# EAGLE design GS_maha (EAGLE 9.6.1)

## Sheet 1 of 2
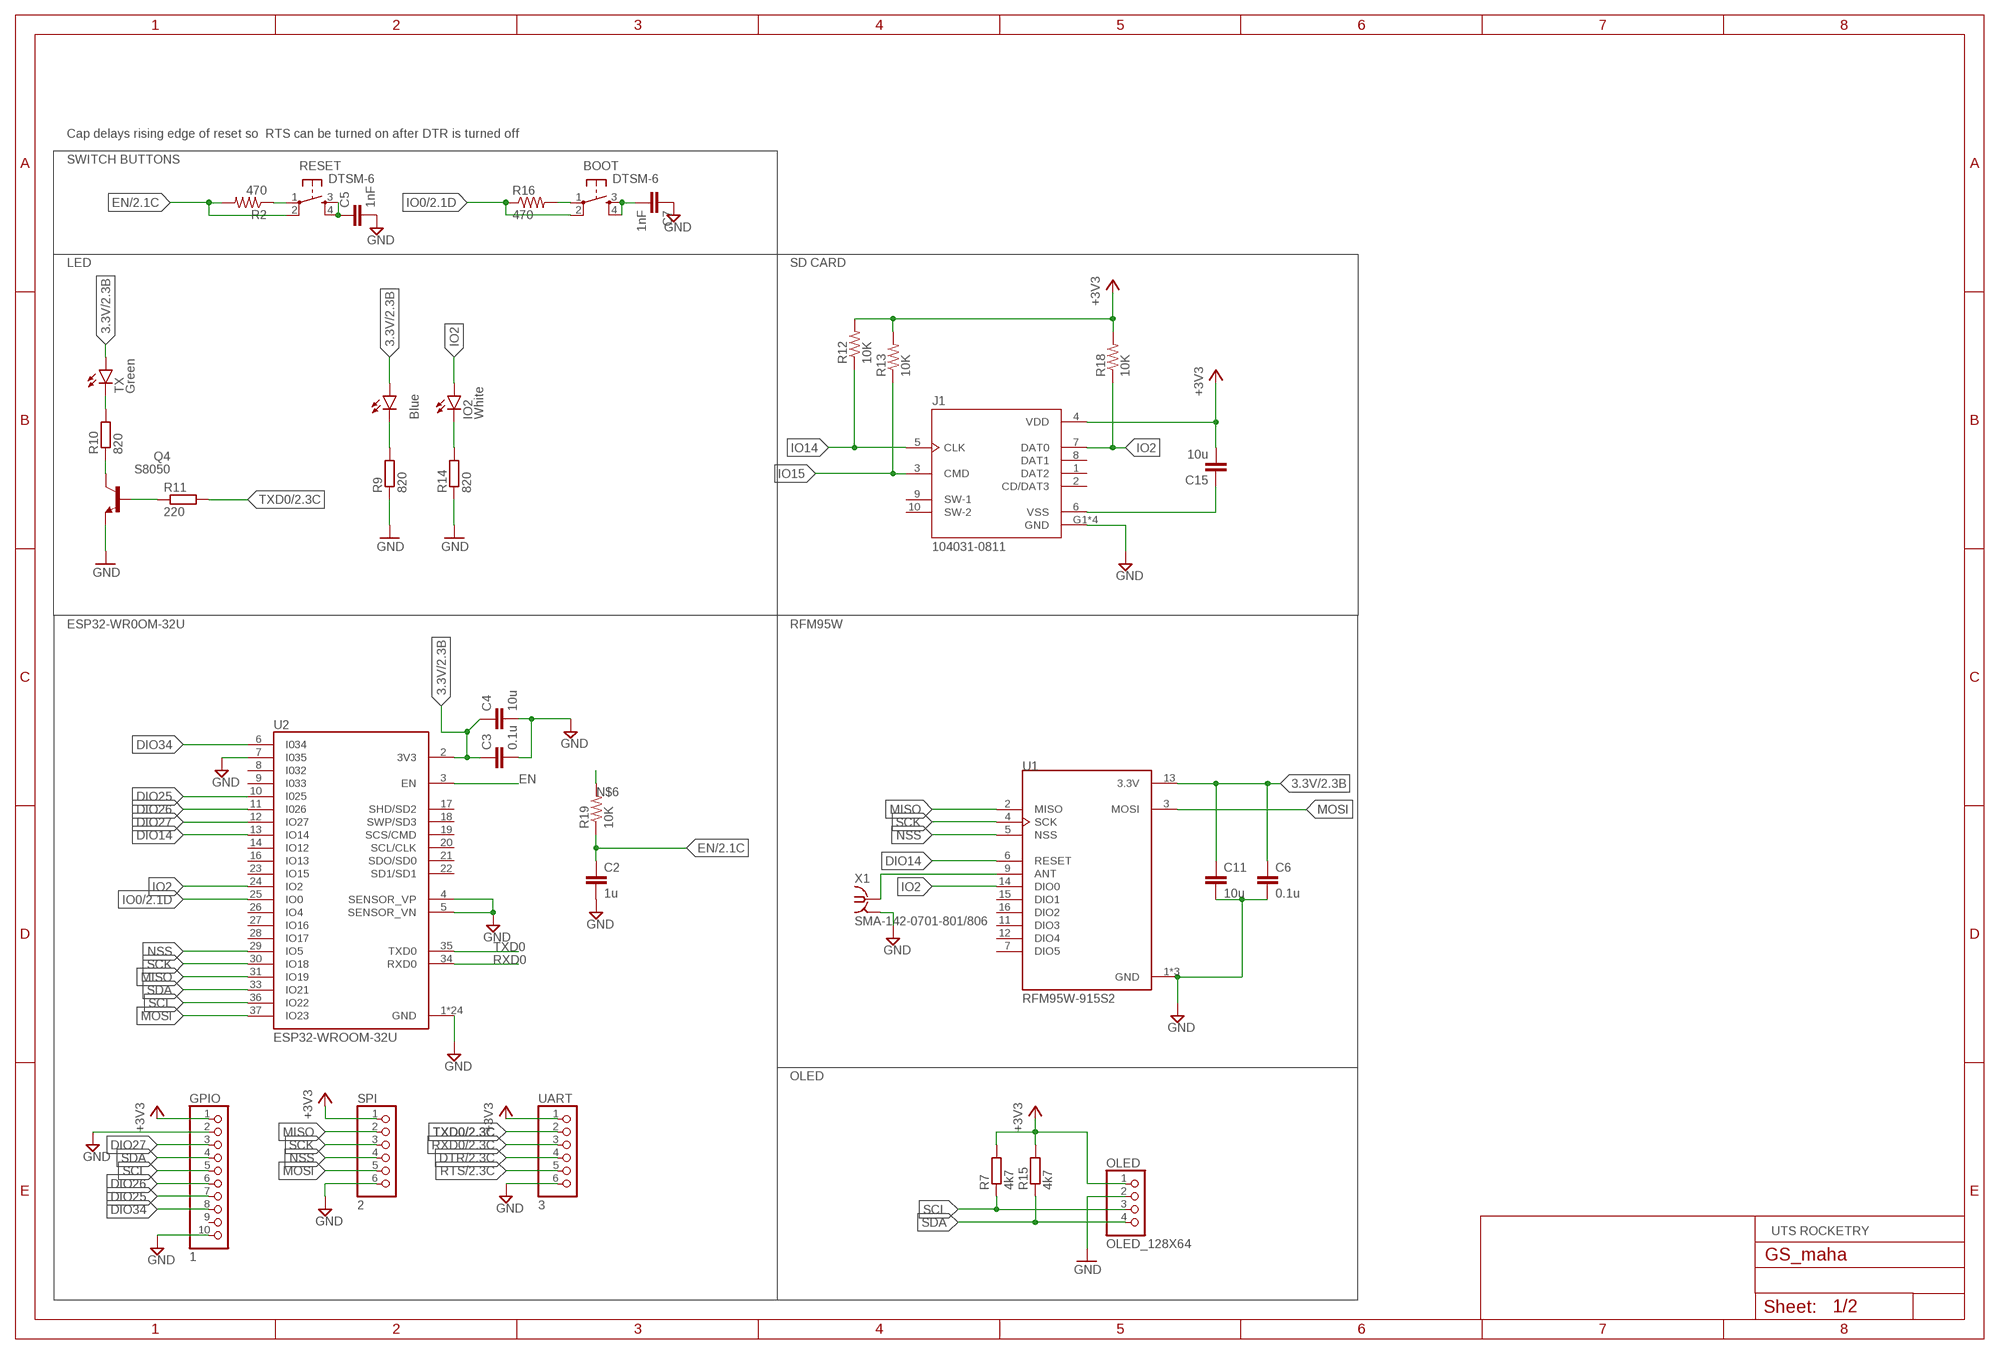
[diagram p0: schematic, sheet 1]

### Parts
BOOT  DTSM-6  [DTSM-6]
C2  1u  C-EUC0805  [C0805]
C3  0.1u  C-EUC0805  [C0805]
C4  10u  C-EUC0805  [C0805]
C5  1nF  C-EUC0805  [C0805]
C6  0.1u  C-EUC0805  [C0805]
C7  1nF  C-EUC0805  [C0805]
C11  10u  C-EUC0805  [C0805]
C15  10u  C-EUC0805  [C0805]
GPIO  1  PINHD-1X10  [1X10]
IO2  White  LEDCHIP-LED0805  [CHIP-LED0805]
J1  104031-0811  [MOLEX_104031-0811]
OLED  OLED_128X64  [OLED_128X64]
PWR  Blue  LEDCHIP-LED0805  [CHIP-LED0805]
Q4  S8050  [SOT95P237X110-3N]
R2  470  R-US_R0805  [R0805]
R7  4k7  R-EU_R0805  [R0805]
R9  820  R-EU_R0805  [R0805]
R10  820  R-EU_R0805  [R0805]
R11  220  R-EU_R0805  [R0805]
R12  10K  R-US_R0805  [R0805]
R13  10K  R-US_R0805  [R0805]
R14  820  R-EU_R0805  [R0805]
R15  4k7  R-EU_R0805  [R0805]
R16  470  R-US_R0805  [R0805]
R18  10K  R-US_R0805  [R0805]
R19  10K  R-US_R0805  [R0805]
RESET  DTSM-6  [DTSM-6]
SPI  2  PINHD-1X6  [1X06]
TX  Green  LEDCHIP-LED0805  [CHIP-LED0805]
U1  RFM95W-915S2  [XCVR_RFM95W-915S2]
U2  ESP32-WROOM-32U  [XCVR_ESP32-WROOM-32U]
UART  3  PINHD-1X6  [1X06]
X1  SMA-142-0701-801/806  [J502-ND-142-0701-801/806]

### Nets
3.3V: C3.1 C4.1 C6.1 C11.1 PWR.A TX.A U1.13(3.3V) U2.2(3V3) ; also sheet 2
+3V3: C15.2 GPIO.1 J1.4(VDD) OLED.1 R7.2 R12.2 R13.2 R15.2 R18.2 SPI.1 UART.1
DIO14: U1.6(RESET) U2.13(IO14)
DIO25: GPIO.7 U2.10(I025)
DIO26: GPIO.6 U2.11(I026)
DIO27: GPIO.3 U2.12(IO27)
DIO34: GPIO.8 U2.6(I034)
DTR: UART.4 ; also sheet 2
EN: C2.1 R2.2 R19.1 RESET.2 U2.3(EN) ; also sheet 2
GND: C2.2 C3.2 C4.2 C5.2 C6.2 C7.1 C11.2 GPIO.2 GPIO.10 J1.G1(GND) J1.G2(GND) J1.G3(GND) J1.G4(GND) OLED.2 Q4.2(E) R9.1 R14.1 SPI.6 U1.1(GND) U1.8(GND) U1.10(GND) U2.1(GND) U2.4(SENSOR_VP) U2.5(SENSOR_VN) U2.7(I035) U2.15(GND) U2.38(GND) U2.G.1(GND) U2.G.2(GND) U2.G.4(GND) U2.G.5(GND) U2.G.6(GND) U2.G.7(GND) U2.G.8(GND) U2.G.9(GND) U2.G.10(GND) U2.G.11(GND) U2.G.12(GND) U2.G.13(GND) U2.G.14(GND) U2.G.15(GND) U2.G.16(GND) U2.G.17(GND) U2.G.18(GND) U2.G.19(GND) U2.G.20(GND) U2.G.21(GND) U2.G.22(GND) UART.6 X1.G@1 X1.G@2 X1.G@3 X1.G@4 ; also sheet 2
IO0: BOOT.2 R16.1 U2.25(IO0) ; also sheet 2
IO2: IO2.A J1.7(DAT0) R18.1 U1.14(DIO0) U2.24(IO2)
IO14: J1.5(CLK) R12.1
IO15: J1.3(CMD) R13.1
MISO: SPI.2 U1.2(MISO) U2.31(IO19)
MOSI: SPI.5 U1.3(MOSI) U2.37(IO23)
N$1: C15.1 J1.6(VSS)
N$2: U1.9(ANT) X1.1
N$3: R2.1 RESET.1
N$4: BOOT.3 BOOT.4 C7.2
N$6: R19.2
N$10: PWR.C R9.2
N$11: IO2.C R14.2
N$13: C5.1 RESET.3 RESET.4
N$14: BOOT.1 R16.2
N$15: Q4.3(C) R10.1
N$17: Q4.1(B) R11.1
N$18: R10.2 TX.C
NSS: SPI.4 U1.5(NSS) U2.29(IO5)
RTS: UART.5 ; also sheet 2
RXD0: U2.34(RXD0) UART.3 ; also sheet 2
SCK: SPI.3 U1.4(SCK) U2.30(IO18)
SCL: GPIO.5 OLED.3 R7.1 U2.36(IO22)
SDA: GPIO.4 OLED.4 R15.1 U2.33(IO21)
TXD0: R11.2 U2.35(TXD0) UART.2 ; also sheet 2
Unconnected: GPIO.9 J1.1(DAT2) J1.2(CD/DAT3) J1.8(DAT1) J1.9(SW-1) J1.10(SW-2) U1.7(DIO5) U1.11(DIO3) U1.12(DIO4) U1.15(DIO1) U1.16(DIO2) U2.8(I032) U2.9(I033) U2.14(IO12) U2.16(IO13) U2.17(SHD/SD2) U2.18(SWP/SD3) U2.19(SCS/CMD) U2.20(SCL/CLK) U2.21(SDO/SD0) U2.22(SD1/SD1) U2.23(IO15) U2.26(IO4) U2.27(IO16) U2.28(IO17)

### Notes on the sheet
- Cap delays rising edge of reset so  RTS can be turned on after DTR is turned off
- SWITCH BUTTONS
- LED | SD CARD
- ESP32-WR0OM-32U | RFM95W
- OLED
- UTS ROCKETRY

## Sheet 2 of 2
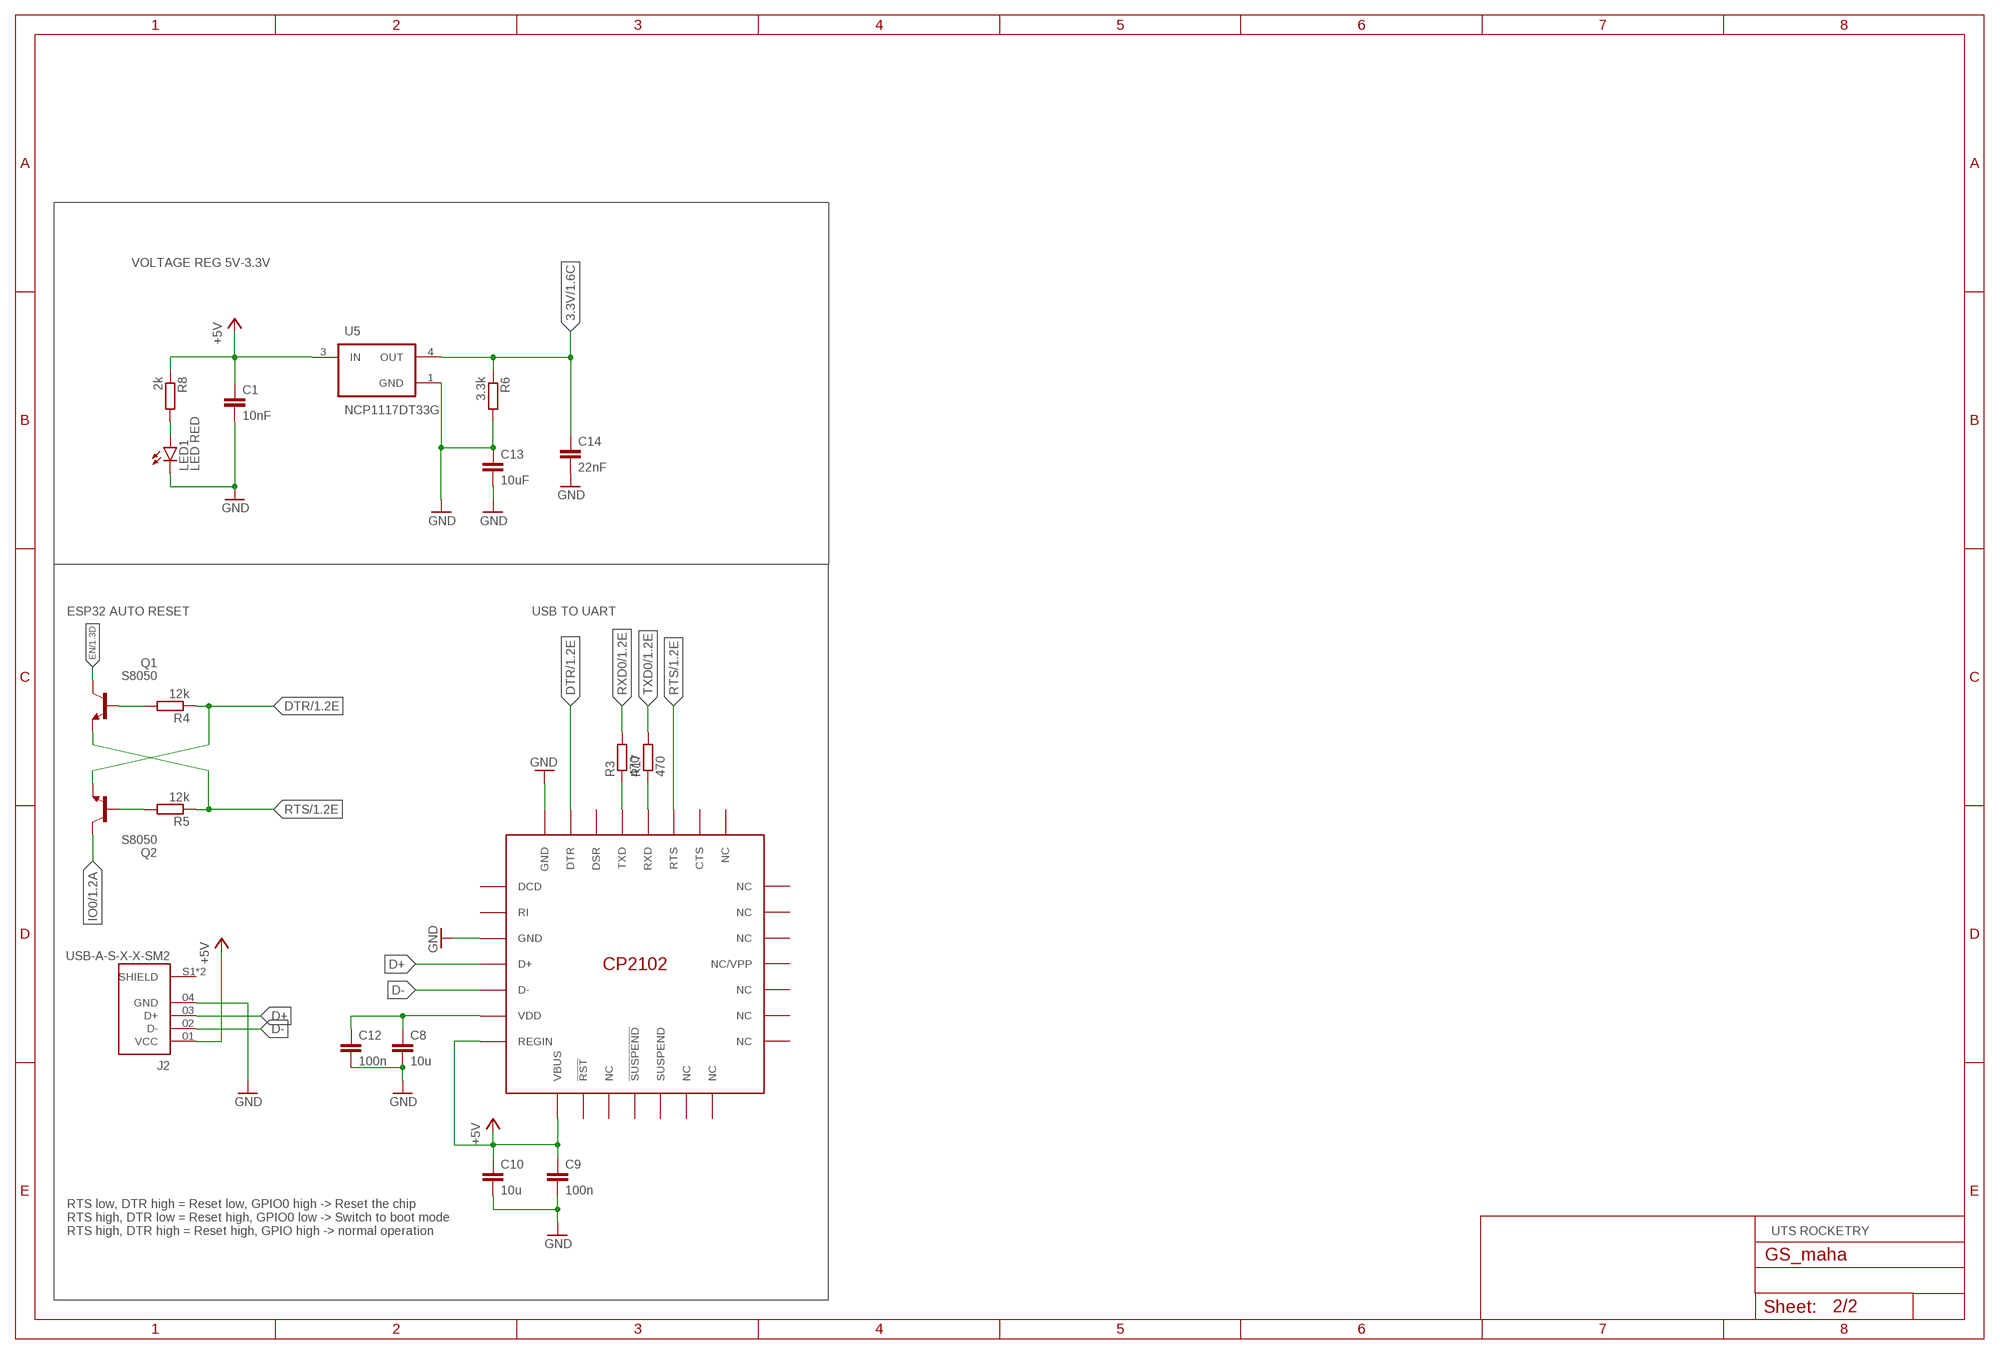
[diagram p1: schematic, sheet 2]

### Parts
C1  10nF  C-EUC0805  [C0805]
C8  10u  C-EUC0805  [C0805]
C9  100n  C-EUC0805  [C0805]
C10  10u  C-EUC0805  [C0805]
C12  100n  C-EUC0805  [C0805]
C13  10uF  C-EUC0805  [C0805]
C14  22nF  C-EUC0805  [C0805]
J2  USB-A-S-X-X-SM2  [SAMTEC_USB-A-S-X-X-SM2]
LED1  LED RED  LEDCHIPLED_0805  [CHIPLED_0805]
Q1  S8050  [SOT95P237X110-3N]
Q2  S8050  [SOT95P237X110-3N]
R3  470  R-EU_R0805  [R0805]
R4  12k  R-EU_R0805  [R0805]
R5  12k  R-EU_R0805  [R0805]
R6  3.3k  R-EU_R0805  [R0805]
R8  2k  R-EU_R0805  [R0805]
R17  470  R-EU_R0805  [R0805]
U3  CP2102  [QFN50P500X500X100-29T300N]
U5  NCP1117DT33G  [VREG_NCP1117DT33G]

### Nets
3.3V: C14.1 R6.1 U5.4(OUT) ; also sheet 1
+5V: C1.1 C9.1 C10.1 J2.01(VCC) R8.1 U3.7(REGIN) U3.8(VBUS) U5.3(IN)
D+: J2.03(D+) U3.4(D+)
D-: J2.02(D-) U3.5(D-)
DTR: Q2.2(E) R4.1 U3.28(DTR) ; also sheet 1
EN: Q1.3(C) ; also sheet 1
GND: C1.2 C8.2 C9.2 C10.2 C12.2 C13.1 C13.2 C14.2 J2.04(GND) LED1.C R6.2 U3.3(GND) U3.29(GND) U5.1(GND) ; also sheet 1
IO0: Q2.3(C) ; also sheet 1
N$5: R17.1 U3.25(RXD)
N$7: R3.1 U3.26(TXD)
N$8: Q1.1(B) R4.2
N$9: Q2.1(B) R5.2
N$12: C8.1 C12.1 U3.6(VDD)
N$23: LED1.A R8.2
RTS: Q1.2(E) R5.1 U3.24(RTS) ; also sheet 1
RXD0: R3.2 ; also sheet 1
TXD0: R17.2 ; also sheet 1
Unconnected: J2.S1(SHIELD) J2.S2(SHIELD) U3.1(DCD) U3.2(RI) U3.9(!RST) U3.10(NC) U3.11(!SUSPEND) U3.12(SUSPEND) U3.13(NC) U3.14(NC) U3.15(NC) U3.16(NC) U3.17(NC) U3.18(NC/VPP) U3.19(NC) U3.20(NC) U3.21(NC) U3.22(NC) U3.23(CTS) U3.27(DSR)

### Notes on the sheet
- VOLTAGE REG 5V-3.3V
- ESP32 AUTO RESET | USB TO UART
- RTS low, DTR high = Reset low, GPIO0 high -> Reset the chip 
  RTS high, DTR low = Reset high, GPIO0 low -> Switch to boot mode 
  RTS high, DTR high = Reset high, GPIO high -> normal operation
- UTS ROCKETRY

## Library data of the parts
BOOT RESET = switch-tact:DTSM-6
C1 C8 C12-C14 = rcl:C-EU: CAPACITOR, European symbol; SPICEPREFIX: C; TME: CC0805KKX7R8105
C2-C7 C11 C15 = rcl:C-EU: CAPACITOR, European symbol; SPICEPREFIX: C
C9 = rcl:C-EU: CAPACITOR, European symbol; SPICEPREFIX: C; TME: CC0805KRX7R8104
C10 = rcl:C-EU: CAPACITOR, European symbol; SPICEPREFIX: C; TME: CL21A106KAYNNNG
GPIO = pinhead:PINHD-1X10: PIN HEADER
IO2 PWR TX = led:LED: LED OSRAM: - CHIPLED LG R971, LG N971, LY N971, LG Q971, LY Q971, LO R971, LY R971 LH N974, LH R974 LS Q976, LO Q976, LY Q976 LO Q996 - Hyper CHIPLED LW Q18S LB Q993, LB Q99A, LB R99A - SideLED LS A670, LO A670, LY A670, LG A670, LP A670 LB A673, LV A673, LT A673, LW A673 LH A674 LY A675 LS A676, LA A676, LO A676, LY A676, LW A676 LS A679, LY A679, LG A679 - Hyper Micro SIDELED® LS Y876, LA Y876, LO Y876, LY Y876 LT Y87S - SmartLED LW L88C, LW L88S LB L89C, LB L89S, LG L890 LS L89K, LO L89K, LY L89K LS L896, LA L896, LO L896, LY L896 - TOPLED LS T670, LO T670, LY T670, LG T670, LP T670 LSG T670, LSP T670, LSY T670, LOP T670, LYG T670 LG T671, LOG T671, LSG T671 LB T673, LV T673, LT T673, LW T673 LH T674 LS T676, LA T676, LO T676, LY T676, LB T676, LH T676, LSB T676, LW T676 LB T67C, LV T67C, LT T67C, LS T67K, LO T67K, LY T67K, LW E67C LS E67B, LA E67B, LO E67B, LY E67B, LB E67C, LV E67C, LT E67C LW T67C LS T679, LY T679, LG T679 LS T770, LO T770, LY T770, LG T770, LP T770 LB T773, LV T773, LT T773, LW T773 LH T774 LS E675, LA E675, LY E675, LS T675 LS T776, LA T776, LO T776, LY T776, LB T776 LHGB T686 LT T68C, LB T68C - Hyper Mini TOPLED® LB M676 - Mini TOPLED Santana® LG M470 LS M47K, LO M47K, LY M47K Source: http://www.osram.convergy.de LUXEON: - LUMILED® LXK2-PW12-R00, LXK2-PW12-S00, LXK2-PW14-U00, LXK2-PW14-V00 LXK2-PM12-R00, LXK2-PM12-S00, LXK2-PM14-U00 LXK2-PE12-Q00, LXK2-PE12-R00, LXK2-PE12-S00, LXK2-PE14-T00, LXK2-PE14-U00 LXK2-PB12-K00, LXK2-PB12-L00, LXK2-PB12-M00, LXK2-PB14-N00, LXK2-PB14-P00, LXK2-PB14-Q00 LXK2-PR12-L00, LXK2-PR12-M00, LXK2-PR14-Q00, LXK2-PR14-R00 LXK2-PD12-Q00, LXK2-PD12-R00, LXK2-PD12-S00 LXK2-PH12-R00, LXK2-PH12-S00 LXK2-PL12-P00, LXK2-PL12-Q00, LXK2-PL12-R00 Source: www.luxeon.com KINGBRIGHT: KA-3528ASYC Source: www.kingbright.com; TME: KP-2012LSURCK
J1 = 104031-0811:104031-0811: 10 (8 + 2) Position Card Connector Secure Digital - microSD™ Surface Mount, Right Angle Gold Check prices <https://pricing.snapeda.com/parts/1040310811/Molex/view-part?ref=eda>; AVAILABILITY: In Stock; DESCRIPTION: 10 (8 + 2) Position Card Connector Secure Digital - microSD™ Surface Mount, Right Angle Gold; MF: Molex; MP: 1040310811; PACKAGE: None; PRICE: None
J2 = USB-A-S-X-X-SM2:USB-A-S-X-X-SM2: USB-A (USB TYPE-A) USB 2.0 Receptacle Connector 4 Position Surface Mount, Right Angle; Through Hole Check prices <https://pricing.snapeda.com/parts/USB-A-S-F-B-SM2-R-TR/Samtec/view-part?ref=eda>; AVAILABILITY: In Stock; DESCRIPTION: USB-A (USB TYPE-A) USB 2.0 Receptacle Connector 4 Position Surface Mount, Right Angle; MF: Samtec; MP: USB-A-S-F-B-SM2-R-TR; PACKAGE: None; PRICE: None; PURCHASE-URL: https://pricing.snapeda.com/search/part/USB-A-S-F-B-SM2-R-TR/?ref=eda
LED1 = led:LED: LED OSRAM: - CHIPLED LG R971, LG N971, LY N971, LG Q971, LY Q971, LO R971, LY R971 LH N974, LH R974 LS Q976, LO Q976, LY Q976 LO Q996 - Hyper CHIPLED LW Q18S LB Q993, LB Q99A, LB R99A - SideLED LS A670, LO A670, LY A670, LG A670, LP A670 LB A673, LV A673, LT A673, LW A673 LH A674 LY A675 LS A676, LA A676, LO A676, LY A676, LW A676 LS A679, LY A679, LG A679 - Hyper Micro SIDELED® LS Y876, LA Y876, LO Y876, LY Y876 LT Y87S - SmartLED LW L88C, LW L88S LB L89C, LB L89S, LG L890 LS L89K, LO L89K, LY L89K LS L896, LA L896, LO L896, LY L896 - TOPLED LS T670, LO T670, LY T670, LG T670, LP T670 LSG T670, LSP T670, LSY T670, LOP T670, LYG T670 LG T671, LOG T671, LSG T671 LB T673, LV T673, LT T673, LW T673 LH T674 LS T676, LA T676, LO T676, LY T676, LB T676, LH T676, LSB T676, LW T676 LB T67C, LV T67C, LT T67C, LS T67K, LO T67K, LY T67K, LW E67C LS E67B, LA E67B, LO E67B, LY E67B, LB E67C, LV E67C, LT E67C LW T67C LS T679, LY T679, LG T679 LS T770, LO T770, LY T770, LG T770, LP T770 LB T773, LV T773, LT T773, LW T773 LH T774 LS E675, LA E675, LY E675, LS T675 LS T776, LA T776, LO T776, LY T776, LB T776 LHGB T686 LT T68C, LB T68C - Hyper Mini TOPLED® LB M676 - Mini TOPLED Santana® LG M470 LS M47K, LO M47K, LY M47K Source: http://www.osram.convergy.de LUXEON: - LUMILED® LXK2-PW12-R00, LXK2-PW12-S00, LXK2-PW14-U00, LXK2-PW14-V00 LXK2-PM12-R00, LXK2-PM12-S00, LXK2-PM14-U00 LXK2-PE12-Q00, LXK2-PE12-R00, LXK2-PE12-S00, LXK2-PE14-T00, LXK2-PE14-U00 LXK2-PB12-K00, LXK2-PB12-L00, LXK2-PB12-M00, LXK2-PB14-N00, LXK2-PB14-P00, LXK2-PB14-Q00 LXK2-PR12-L00, LXK2-PR12-M00, LXK2-PR14-Q00, LXK2-PR14-R00 LXK2-PD12-Q00, LXK2-PD12-R00, LXK2-PD12-S00 LXK2-PH12-R00, LXK2-PH12-S00 LXK2-PL12-P00, LXK2-PL12-Q00, LXK2-PL12-R00 Source: www.luxeon.com KINGBRIGHT: KA-3528ASYC Source: www.kingbright.com
OLED = fossa:OLED_128X64
Q1 Q2 Q4 = fossa:S8050; TME: MMSS8050-H-TP
R2 R12 R13 R16 R18 R19 = rcl:R-US_: RESISTOR, American symbol; SPICEPREFIX: R
R3 R17 = rcl:R-EU_: RESISTOR, European symbol; SPICEPREFIX: R; TME: SMD0805-470R
R4-R6 R8 = rcl:R-EU_: RESISTOR, European symbol; SPICEPREFIX: R; TME: SMD0805-12K
R7 R15 = rcl:R-EU_: RESISTOR, European symbol; SPICEPREFIX: R; TME: SMD0805-4K7
R9 R10 R14 = rcl:R-EU_: RESISTOR, European symbol; SPICEPREFIX: R; TME: SMD0805-820R
R11 = rcl:R-EU_: RESISTOR, European symbol; SPICEPREFIX: R; TME: SMD0805-220R
SPI UART = pinhead:PINHD-1X6: PIN HEADER
U1 = RFM95W-915S2:RFM95W-915S2: RFM95(W) - Low Power Long Range Transceiver Module V1.0 Check prices <https://pricing.snapeda.com/parts/RFM95W-915S2/RF%20Solutions/view-part?ref=eda>; AVAILABILITY: In Stock; DESCRIPTION: General ISM < 1GHz LoRa™ Transceiver Module 915MHz Surface Mount; MF: RF Solutions; MP: RFM95W-915S2; PACKAGE: SMD-16 RF Solutions; PRICE: None
U2 = ESP32-WROOM-32U:ESP32-WROOM-32U: Wi-Fi/BT BLE Module ESP32-D0WD SPI Flash UART U.FL Conn. Check prices <https://pricing.snapeda.com/parts/ESP32-WROOM-32U/Espressif%20Systems/view-part?ref=eda>; AVAILABILITY: In Stock; DESCRIPTION: Bluetooth, WiFi 802.11b/g/n, Bluetooth v4.2 +EDR, Class 1, 2 and 3 Transceiver Module 2.4GHz ~ 2.5GHz Antenna Not Included, U.FL Surface Mount; MF: Espressif Systems; MP: ESP32-WROOM-32U; PACKAGE: Module Espressif Systems; PRICE: None
U3 = fossa:CP2102; TME: CP2102-GM
U5 = NCP1117DT33G:NCP1117DT33G: 1.0 A Positive LDO Linear Voltage Regulator (Fixed and Adjustable) Vout: 3.3 V Check prices <https://pricing.snapeda.com/parts/NCP1117DT33G/ON%20Semiconductor/view-part?ref=eda>; AVAILABILITY: In Stock; DESCRIPTION: Linear Voltage Regulator IC Positive Fixed 1 Output 1A DPAK; MF: ON Semiconductor; MP: NCP1117DT33G; PACKAGE: DPAK-3 ON Semiconductor; PRICE: None
X1 = con-coax:SMA-: SMA 50 Ohm End Launch Jack Receptacle - Round Contact Johnson Components Source: www.johnsoncomponents.com .. J502-ND.pdf; MF: JOHNSON COMPONENTS; MPN: 142-0701-801; OC_FARNELL: 1608592; OC_NEWARK: 90F2624

## Board
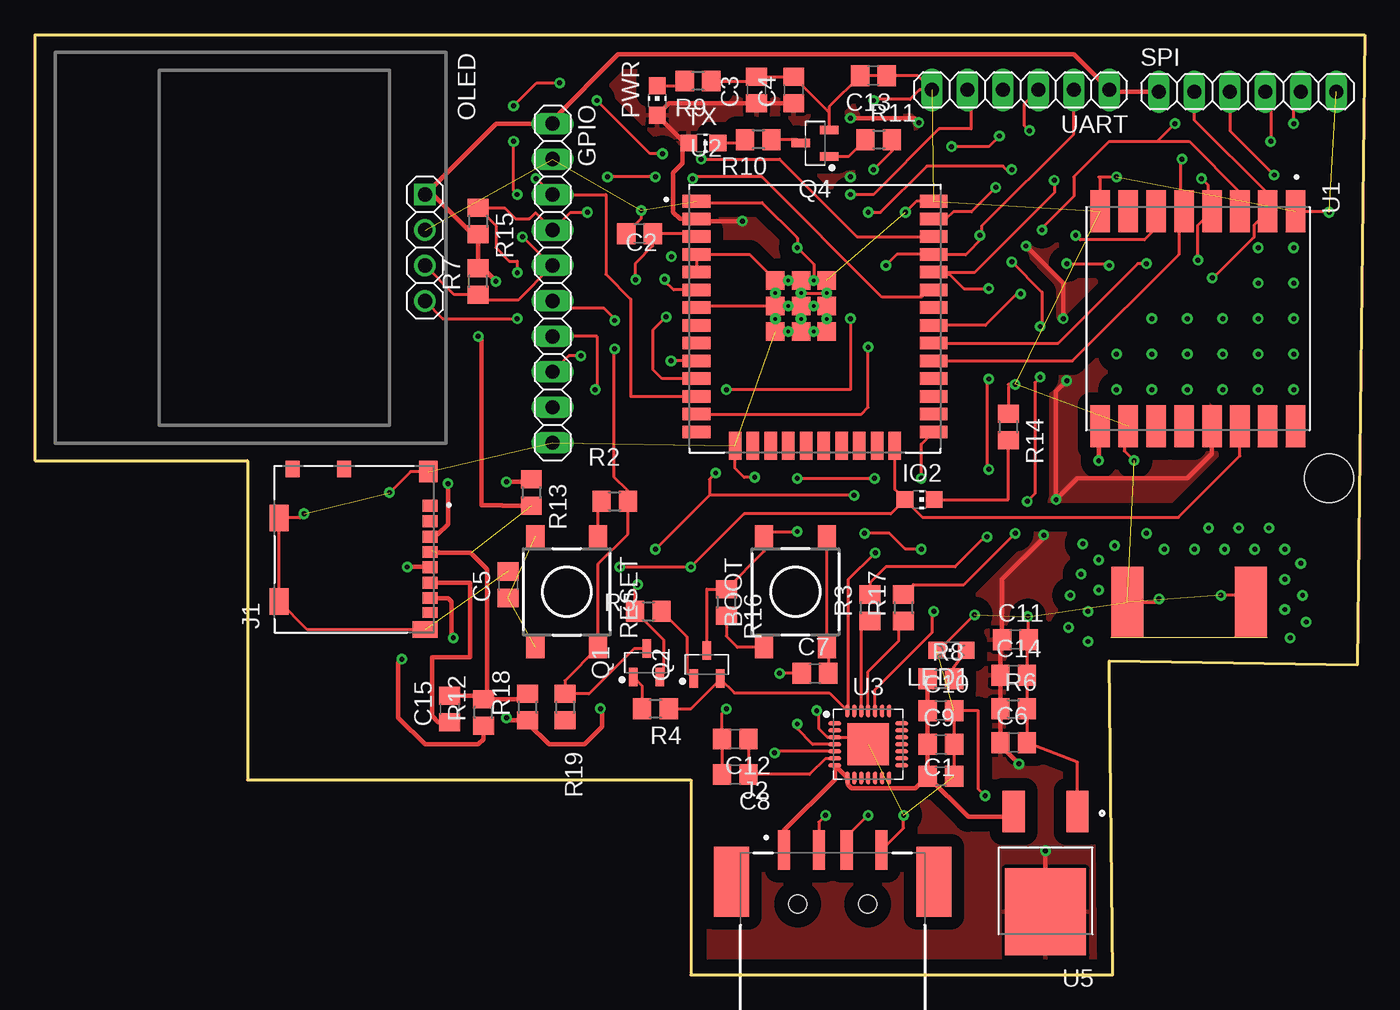
[diagram p2: board, top side]
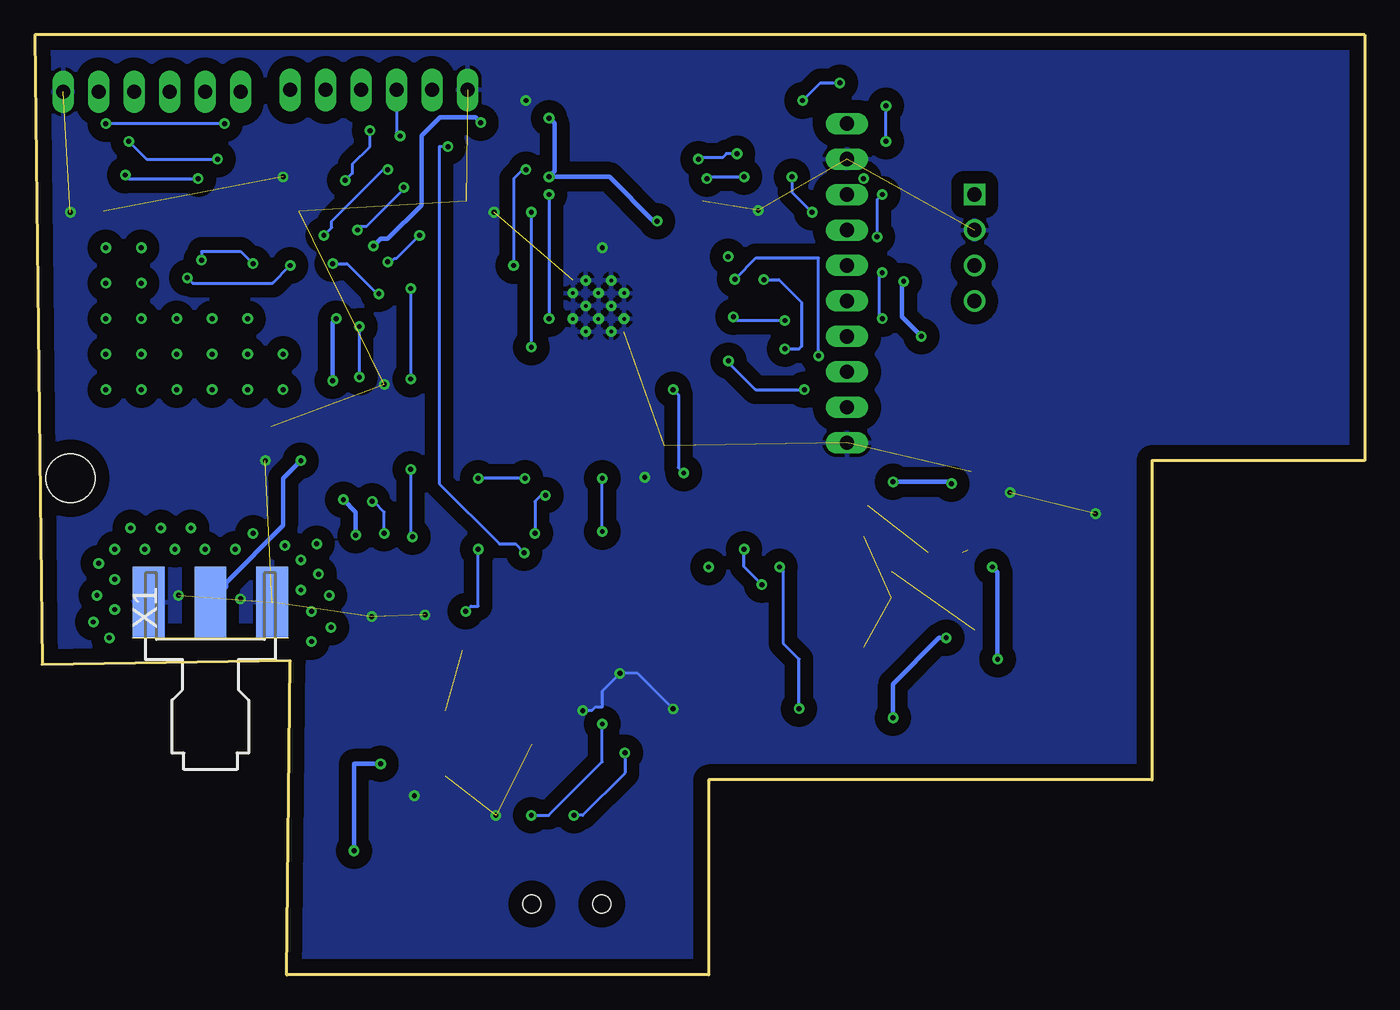
[diagram p3: board, bottom side, seen from below]

Size 95.25 x 67.31 mm. Coordinates in mm from the lower left corner, seen from the top.
Outline: 0,67.31 95.25,67.31 94.74,22.22 76.96,22.48 77.22,0 46.99,0 46.99,13.97 15.24,13.97 15.24,36.83 0,36.83 0,67.31
Copper layers (1*16): Top 0.035mm / dielectric 1.5mm / Bottom 0.035mm
Design rules "default *": minimum track width 6mil, minimum drill 0.35mm, track to track 36mil, track to pad 6mil, pad to pad 6mil, via to via 6mil, smd to smd 6mil, copper to edge 40mil, drill to drill 6mil, minimum pad ring 10mil, minimum via ring 8mil, stop-mask expansion 4mil, vias tented up to drill 0mil, thermal gap 10mil
Holes 3.5 mm at 92.71,35.56

### Footprints (pad centres in the part's own frame; a part is rotated, then mirrored left to right if it is on the bottom)
DTSM-6 = smd 1.55 x 1.3: 1 -3.975,2.25; 2 3.975,2.25; 3 -3.975,-2.25; 4 3.975,-2.25
C0805 = smd 1.3 x 1.5: 1 -0.95,0; 2 0.95,0
1X10 = drill 1.016 long: 1 -11.43,0; 2 -8.89,0; 3 -6.35,0; 4 -3.81,0; 5 -1.27,0; 6 1.27,0; 7 3.81,0; 8 6.35,0; 9 8.89,0; 10 11.43,0
CHIP-LED0805 = smd 1.2 x 1.2: A 0,-1.05; C 0,1.05
MOLEX_104031-0811 = smd 0.85 x 1.1: 1 3.105,-5.45; 2 2.005,-5.45; 3 0.905,-5.45; 4 -0.195,-5.45; 5 -1.295,-5.45; 6 -2.395,-5.45; 7 -3.495,-5.45 | smd 0.75 x 1.1: 8 -4.545,-5.45 | smd 1.2 x 1: 9 5.74,0.7; 10 5.74,4.4 | smd 1.55 x 1.35: G1 5.565,-5.325 | smd 1.17 x 1.8: G2 -5.755,-5.1 | smd 1.9 x 1.35: G3 -3.73,5.375; G4 2.24,5.375
SAMTEC_USB-A-S-X-X-SM2 = smd 0.9 x 2.8: 01 -3.5,3.85; 02 -1,3.85; 03 1,3.85; 04 3.5,3.85 | smd 2.5 x 5: S1 -7.25,1.6; S2 7.25,1.6 | hole 1.3: -2.5,0; 2.5,0
CHIPLED_0805 = smd 1.2 x 1.2: A 0,-1.05; C 0,1.05
OLED_128X64 = drill 1.016 square: 1 -3.81,0 | drill 1.016: 2 -1.27,0; 3 1.27,0; 4 3.81,0
SOT95P237X110-3N = smd 1.322 x 0.609: 1 -1.014,0.95; 2 -1.014,-0.95; 3 1.014,0
R0805 = smd 1.3 x 1.5: 1 -0.95,0; 2 0.95,0
1X06 = drill 1.016 long: 1 -6.35,0; 2 -3.81,0; 3 -1.27,0; 4 1.27,0; 5 3.81,0; 6 6.35,0
XCVR_RFM95W-915S2 = smd 3 x 1.4: 1 -7.7,7; 2 -7.7,5; 3 -7.7,3; 4 -7.7,1; 5 -7.7,-1; 6 -7.7,-3; 7 -7.7,-5; 8 -7.7,-7; 9 7.7,-7; 10 7.7,-5; 11 7.7,-3; 12 7.7,-1; 13 7.7,1; 14 7.7,3; 15 7.7,5; 16 7.7,7
XCVR_ESP32-WROOM-32U = smd 2 x 0.9: 1 -8.5,8.41; 2 -8.5,7.14; 3 -8.5,5.87; 4 -8.5,4.6; 5 -8.5,3.33; 6 -8.5,2.06; 7 -8.5,0.79; 8 -8.5,-0.48; 9 -8.5,-1.75; 10 -8.5,-3.02; 11 -8.5,-4.29; 12 -8.5,-5.56; 13 -8.5,-6.83; 14 -8.5,-8.1; 25 8.5,-8.1; 26 8.5,-6.83; 27 8.5,-5.56; 28 8.5,-4.29; 29 8.5,-3.02; 30 8.5,-1.75; 31 8.5,-0.48; 32 8.5,0.79; 33 8.5,2.06; 34 8.5,3.33; 35 8.5,4.6; 36 8.5,5.87; 37 8.5,7.14; 38 8.5,8.41 | smd 0.9 x 2: 15 -5.715,-9.1; 16 -4.445,-9.1; 17 -3.175,-9.1; 18 -1.905,-9.1; 19 -0.635,-9.1; 20 0.635,-9.1; 21 1.905,-9.1; 22 3.175,-9.1; 23 4.445,-9.1; 24 5.715,-9.1 | smd 1.33 x 1.33: G.1 0.835,2.745; G.2 -1,2.745; G.4 -2.835,2.745; G.5 0.835,0.91; G.6 -1,0.91; G.7 -2.835,0.91; G.8 0.835,-0.925; G.9 -1,-0.925; G.10 -2.835,-0.925 | drill 0.254: G.11 -0.083,2.745; G.12 -1.917,2.745; G.13 0.835,1.827; G.14 -1,1.827; G.15 -2.835,1.827; G.16 -0.083,0.91; G.17 -1.917,0.91; G.18 0.835,-0.007; G.19 -1,-0.007; G.20 -2.835,-0.007; G.21 -0.083,-0.925; G.22 -1.917,-0.925
QFN50P500X500X100-29T300N = smd 0.919 x 0.27: 1 -2.396,1.5; 2 -2.396,1; 3 -2.396,0.5; 4 -2.396,0; 5 -2.396,-0.5; 6 -2.396,-1; 7 -2.396,-1.5; 15 2.396,-1.5; 16 2.396,-1; 17 2.396,-0.5; 18 2.396,0; 19 2.396,0.5; 20 2.396,1; 21 2.396,1.5 | smd 0.27 x 0.919: 8 -1.5,-2.396; 9 -1,-2.396; 10 -0.5,-2.396; 11 0,-2.396; 12 0.5,-2.396; 13 1,-2.396; 14 1.5,-2.396; 22 1.5,2.396; 23 1,2.396; 24 0.5,2.396; 25 0,2.396; 26 -0.5,2.396; 27 -1,2.396; 28 -1.5,2.396 | smd 3 x 3: 29 0,0
VREG_NCP1117DT33G = smd 1.6 x 3: 1 -2.285,-4.08; 3 2.285,-4.08 | smd 5.8 x 6.2: 4 0,3.1
J502-ND-142-0701-801/806 = smd 5.08 x 2.286: 1 2.565,0; G@1 2.565,4.42; G@2 2.565,-4.42 | smd 5.08 x 2.286 bottom: G@3 2.565,4.42; G@4 2.565,-4.42

### Placement (x,y rotation side)
BOOT  54.48,27.43 90 top
C1  64.9,14.22 0 top
C2  43.31,53.09 180 top
C3  51.69,63.37 90 top
C4  54.36,63.37 90 top
C5  33.91,27.94 90 top
C6  70.1,16.64 0 top
C7  55.88,21.59 0 top
C8  50.16,14.35 180 top
C9  64.9,16.51 0 top
C10  64.9,18.92 0 top
C11  70.23,24 0 top
C12  50.16,16.89 180 top
C13  60.07,64.39 180 top
C14  70.1,21.46 0 top
C15  29.72,19.05 90 top
GPIO  37.08,49.53 270 top
IO2  63.37,34.04 270 top
J1  22.86,30.48 90 top
J2  57.15,5.08 0 top
LED1  65.66,23.24 90 top
OLED  27.94,52.07 270 top
PWR  44.58,62.61 0 top
Q1  43.81,22.35 90 top
Q2  48.13,22.22 90 top
Q4  55.88,59.56 180 top
R2  41.53,33.91 0 top
R3  59.82,26.29 90 top
R4  44.45,19.05 180 top
R5  43.94,26.04 0 top
R6  70.1,19.05 0 top
R7  31.75,49.66 90 top
R8  64.9,21.21 0 top
R9  47.5,64.01 180 top
R10  51.82,59.82 180 top
R11  60.45,59.82 0 top
R12  32.13,18.8 90 top
R13  35.56,34.54 270 top
R14  69.72,39.24 270 top
R15  31.75,53.98 270 top
R16  49.53,26.67 270 top
R17  62.23,26.29 90 top
R18  35.31,19.18 90 top
R19  37.97,19.18 270 top
RESET  38.1,27.43 270 top
SPI  86.87,63.25 0 top
TX  47.88,59.56 270 top
U1  83.31,46.99 270 top
U2  55.88,46.99 0 top
U3  59.69,16.51 0 top
U5  72.39,7.62 180 top
UART  70.61,63.37 180 top
X1  82.68,24.13 90 bottom

### Tracks (layer width: path | path; a pad name or v marks a point on that pad's centre or on a via)
3.3V  (via drill 0.35)
  Top 0.305: C4.1 C3.1 45.44,62.42 PWR.A 46.57,59.56 TX.A 46.4,59.14 46.4,58.14 45.72,57.45 45.72,54.61 46.2,54.13 U2.2 47.53,53.98 v50.67,53.98 | v73.66,46.99 73.66,49.48 73.71,49.48 v70.99,52.2 | v63.32,61.03 63,61.35 v58.42,61.35 | v72.39,8.89 U5.4 | v70.48,15.11 69.15,16.44 C6.1 R6.1 C14.1 69.15,23.88 C11.1 69.28,28.32 72.26,31.3 v72.26,31.5 | U1.13 84.31,37.32 82.55,35.56 74.68,35.56 v73.15,34.04 73.15,41.78 v73.91,42.55
  Bottom 0.305: v50.67,53.98 50.93,53.98 54.1,57.15 v58.42,57.15 58.04,57.53 58.04,60.97 v58.42,61.35 | v70.99,52.2 70.48,52.71 69.98,52.71 67.56,55.12 67.56,60.09 66.24,61.41 63.7,61.41 v63.32,61.03 | v70.48,15.11 72.39,15.11 v72.39,8.89 | v72.26,31.5 72.26,33.15 v73.15,34.04 | v73.91,42.55 73.91,46.74 v73.66,46.99
  pour Top: -11.43,68.58 -11.43,-7.75 114.3,-7.75 114.3,68.58
+3V3  (via drill 0.35)  (2 unrouted)
  Top 0.305: J1.4 28.43,30.4 | SPI.1 77.09,63.25 UART.1 74.42,65.91 41.78,65.91 37.08,61.21 GPIO.1 33.02,60.96 OLED.1 28.51,55.88 31.37,53.03 R15.2 R7.2 31.75,50.8 31.88,50.8 v33.02,49.66 | R18.2 34.92,19.75 R12.2 | R12.2 32.38,20 32.38,29.06 31.22,30.22 | 29.72,20.25 C15.2 31.88,20 R12.2 | 31.22,30.22 31.24,30.22 | v31.75,45.72 32,45.47 32,33.65 33.45,33.65 33.5,33.59 R13.2 | 28.81,30.22 29,30.22 | 29,30.22 31.22,30.22 | 29,30.22 28.94,30.28
  Bottom 0.305: v31.75,45.72 33.15,47.12 33.15,49.53 v33.02,49.66
+5V
  Top 0.305: J2.01 53.65,10.34 57.29,13.99 U3.7 U3.8 58.25,14.05 58.25,13.61 58.51,13.35 63.07,13.35 C1.1 | R8.1 C10.1 C9.1 C1.1 | U5.3 69.72,11.32 66.85,11.32 C1.1
D+  (via drill 0.35)
  Top 0.203: v59.69,11.43 58.15,9.89 J2.03 | U3.4 55.71,16.51 54.61,17.61 v54.61,17.96
  Bottom 0.203: v59.69,11.43 58.44,11.43 54.61,15.26 v54.61,17.96
D-  (via drill 0.35)
  Top 0.203: U3.5 52.98,16.01 v52.98,15.9 | v56.64,11.43 56.15,10.94 J2.02
  Bottom 0.203: v52.98,15.9 52.98,14.45 56.01,11.43 v56.64,11.43
DIO14  (via drill 0.35)
  Top 0.203: U1.6 80.31,53.47 79.48,52.64 74.87,52.64 v74.55,52.96 | U2.13 59.21,40.16 59.69,40.64 v59.69,44.96 | v59.69,54.61 60.58,54.61 63.88,57.91 69.34,57.91 69.6,57.66 v69.98,57.66
  Bottom 0.203: v59.69,44.96 v59.69,54.61 | v69.98,57.66 70.3,57.66 73.99,53.97 73.99,53.52 v74.55,52.96
DIO25  (via drill 0.35)
  Top 0.203: GPIO.7 40.26,45.72 40.26,42.04 v40.13,41.91 | U2.10 v45.56,43.97
  Bottom 0.203: v45.56,43.97 45.56,43.84 43.63,41.91 v40.13,41.91
DIO26  (via drill 0.35)
  Top 0.203: v41.53,46.86 41.53,46.99 40.77,47.75 37.59,47.75 GPIO.6 | U2.11 44.93,42.7 44.25,43.38 44.25,46.15 v45.21,47.12
  Bottom 0.203: v45.21,47.12 44.96,46.86 v41.53,46.86
DIO27  (via drill 0.35)
  Top 0.203: v35.89,57.02 35.94,57.02 GPIO.3 40.89,55.88 40.89,50.17 42.67,48.39 42.67,41.4 47.35,41.4 U2.12
DIO34  (via drill 0.35)
  Top 0.203: U2.6 45.75,49.05 45.11,49.69 v45.11,49.81 | v39.12,44.32 38.23,44.32 GPIO.8
  Bottom 0.203: v45.11,49.81 43.59,51.34 39.12,51.34 v39.12,44.32
DTR  (via drill 0.35)
  Top 0.203: R4.1 46.99,19.05 49.08,21.14 Q2.2 50.1,20.19 56.9,20.19 U3.28 58.25,18.97 58.25,28.28 v60.2,30.23 | v69.09,60.07 68.33,59.31 v65.66,59.31
  Bottom 0.203: v60.2,30.23 60.83,30.86 61.98,30.86 66.29,35.18 66.29,59.31 v65.66,59.31 | UART.4 69.34,60.33 v69.09,60.07
EN  (via drill 0.35)
  Top 0.203: Q1.3 42.93,23.37 39.69,20.13 R19.1 37.97,21.08 RESET.2 40.35,29.43 42.48,31.56 R2.2 42.48,34.66 41.45,35.69 41.45,44.76 v41.53,44.83 | U2.3 47.15,53.09 C2.1 44.26,52.2 43.03,50.97 v43.03,49.78
  Bottom 0.203: v41.53,44.83 40.51,44.83 40.34,45.01 40.34,48.16 41.96,49.78 v43.03,49.78
GND  (via drill 0.35)  (22 unrouted)
  Top 0.203: C8.2 C12.2 49.21,18.73 v49.53,19.05 | X1.G@3 86.59,26.7 86.11,27.18 v84.96,27.18 | v80.52,26.92 80.29,26.7 X1.G@4 | U1.1 92.63,54.69 v92.71,54.61 | v70.23,42.29 69.72,42.29 R14.1 | C1.2 C9.2 C10.2 67.56,18.92 67.56,13.33 v68.07,12.83 | U5.1 74.67,15.23 C6.2 R6.2 C14.2 71.05,23.88 C11.2 71.18,25.59 v71.12,25.65 | U1.10 78.04,39.02 78.04,37.53 v78.74,36.83 | U2.G.11 55.8,50.88 v54.61,52.07 54.61,52.78 52.1,55.29 47.49,55.29 U2.1 | U2.G.11 U2.G.12 | U2.G.12 U2.G.15 | U2.G.15 U2.G.17 U2.G.20 U2.G.22 | U2.G.22 U2.G.19 U2.G.21 | U2.G.21 U2.G.18 | U2.G.18 U2.G.16 | U2.G.16 U2.G.14 | U2.G.14 U2.G.13 | U2.G.13 U2.G.11 | C7.1 v53.34,21.59 | U2.7 47.5,47.9 U2.G.7 U2.G.15 | U2.5 U2.4 51.19,51.59 U2.G.4 U2.G.12 | v43.43,54.74 43.43,54.16 C2.2 | U2.38 63.15,55.4 v62.36,54.61 | v77.47,57.15 77.44,57.12 76.2,57.12 76.31,57.01 U1.8 | R9.1 51.37,64.01 C3.2 C4.2 56.89,61.78 Q4.2 56.89,62.16 C13.2 C13.1 63.25,64.39 UART.6 63.37,63.37 62.7,62.7 60.16,62.7 v60.07,62.61 | U2.G.5 U2.G.16 | U2.G.8 U2.G.18 | U2.G.21 U2.G.9 U2.G.22 | U2.G.6 U2.G.14 | U2.G.10 U2.G.22 | U3.29 59.19,17.01 U3.3 56.78,17.01 56.13,17.65 56.13,18.8 v56.01,18.92 | J1.G2 19.51,24.72 J1.G3 J1.G4 18.98,32.72 v19.28,33.02 | J1.G1 26.9,36.05 v25.4,34.54 | J2.04 62.23,10.51 v62.23,11.43 | U2.G.13 U2.G.1 | U2.G.2 U2.G.14 | v51.56,35.64 v51.56,35.63 50.8,35.63 50.16,36.27 U2.15 | v67.31,25.78 64.77,23.24 LED1.C
  Bottom 0.203: v56.01,18.92 55.37,18.92 55.11,19.18 54.61,19.18 54.61,20.32 v53.34,21.59 52.07,21.59 v49.53,19.05
  pour Bottom: -12.7,68.58 -12.7,-7.62 114.3,-7.62 114.3,68.58
IO0  (via drill 0.35)
  Top 0.203: Q2.3 48.13,27.62 R16.1 52.23,30.32 BOOT.2 52.58,31.75 v54.61,31.75 | v54.61,35.56 v60.15,35.56 | v63.5,35.56 63.5,38.01 U2.25
  Bottom 0.203: v54.61,31.75 v54.61,35.56 | v60.15,35.56 v63.5,35.56
IO2  (via drill 0.35)
  Top 0.203: IO2.A 61.59,34.76 U2.24 | IO2.A 61.31,33.02 50.8,33.02 v46.99,29.21 v41.91,29.21 | IO2.A 63.59,32.77 81.91,32.77 86.31,37.16 U1.14
  Top 0.305: v40.51,19.06 40.64,18.94 40.64,17.78 39.37,16.51 36.83,16.51 35.31,18.03 R18.1 33.97,18.23 v33.78,18.41 | v29.98,24.13 29.85,24.26 29.85,26.72 29.58,26.98 J1.7
  Bottom 0.203: v41.91,29.21 41.66,28.96 41.66,23.76 40.51,22.62 v40.51,19.06
  Bottom 0.305: v33.78,18.41 33.78,20.83 30.48,24.13 v29.98,24.13
IO14  (via drill 0.35)
  Top 0.305: R12.1 32.13,16.89 31.75,16.51 27.94,16.51 26.03,18.41 26.03,22.35 v26.29,22.61 | J1.5 28.28,29.21 v26.67,29.21
  Bottom 0.305: v26.67,29.21 26.29,28.83 v26.29,22.61
IO15  (via drill 0.35)
  Top 0.203: J1.3 28.43,31.5
  Top 0.305: R13.1 35.37,35.31 v33.78,35.31 | 28.43,31.5 28.81,31.5 29.59,32.29 v29.59,35.18
  Bottom 0.305: v33.78,35.31 29.72,35.31 v29.59,35.18
MISO  (via drill 0.35)
  Top 0.203: v70.61,48.77 70.36,48.77 68.1,46.51 U2.31 | SPI.2 83.06,61.21 88.31,55.96 U1.2 87.32,53.7 87.32,52.81 84.42,49.91 v84.33,49.91 | v76.96,50.8 76.83,50.93 v73.91,50.93
  Bottom 0.203: v76.96,50.8 78.23,49.53 83.95,49.53 v84.33,49.91 | v73.91,50.93 72.9,50.93 70.74,48.77 v70.61,48.77
MOSI  (via drill 0.35)
  Top 0.203: U2.37 65.27,54.13 65.78,54.65 67.09,54.65 v68.83,56.39 | v72.14,53.34 72.14,53.47 74.42,55.75 74.42,57.15 76.96,59.69 80.39,59.69 | 80.39,59.69 82.68,59.69 86.36,56.01 86.36,54.61 86.31,54.66 U1.3 | 80.39,59.69 v81.66,60.96 | v90.17,60.96 90.17,62.74 SPI.5
  Bottom 0.203: v72.14,53.34 71.88,53.59 71.5,53.59 68.83,56.26 v68.83,56.39 | v81.66,60.96 v90.17,60.96
N$1
  Top 0.305: J1.6 31.17,28.09 31.17,22.73 28.45,22.73 28.45,18.54 28.89,18.1 C15.1
N$2  (via drill 0.35)
  Top 0.305: v76.2,36.83 76.2,39.18 U1.9
  Bottom 0.305: v76.2,36.83 77.47,35.56 77.47,32.19 81.57,28.1 81.57,27.81 X1.1
N$3
  Top 0.203: RESET.1 40.35,33.68 R2.1
N$4
  Top 0.203: C7.2 56.83,23.36 BOOT.3 BOOT.4
N$5
  Top 0.203: R17.1 61.85,24.96 61.85,23.88 59.69,21.72 U3.25
N$7
  Top 0.203: R3.1 59.19,24.71 U3.26
N$8
  Top 0.203: Q1.1 43.5,20.7 R4.2
N$9
  Top 0.203: Q2.1 46.71,21.68 46.71,24.22 R5.2
N$10
  Top 0.203: PWR.C 46.2,63.66 R9.2
N$11
  Top 0.203: IO2.C 69.72,34.04 R14.2
N$12
  Top 0.203: C12.1 C8.1 55.5,14.35 56.66,15.51 U3.6
N$13  (2 unrouted)
N$14
  Top 0.203: BOOT.1 50.33,23.46 49.53,24.25 R16.2
N$15
  Top 0.203: Q4.3 54.61,59.82 R10.1
N$16  (via drill 0.35)
  other vias: 45.59,51.44
N$17
  Top 0.203: Q4.1 58.3,58.61 R11.1
N$18
  Top 0.203: R10.2 50.61,59.56 TX.C
N$19  (via drill 0.35)
  other vias: 90.17,41.91
N$20  (via drill 0.35)
  other vias: 87.63,41.91
N$21  (via drill 0.35)
  other vias: 85.09,41.91
N$22  (via drill 0.35)
  other vias: 82.55,41.91
N$23
  Top 0.203: R8.2 65.85,22.08 LED1.A
N$24  (via drill 0.35)
  other vias: 80.01,41.91
N$25  (via drill 0.35)
  other vias: 77.47,41.91
N$26  (via drill 0.35)
  other vias: 90.17,44.45
N$27  (via drill 0.35)
  other vias: 87.63,44.45
N$28  (via drill 0.35)
  other vias: 85.09,44.45
N$29  (via drill 0.35)
  other vias: 82.55,44.45
N$30  (via drill 0.35)
  other vias: 80.01,44.45
N$31  (via drill 0.35)
  other vias: 90.17,46.99
N$32  (via drill 0.35)
  other vias: 87.63,46.99
N$33  (via drill 0.35)
  other vias: 85.09,46.99
N$34  (via drill 0.35)
  other vias: 82.55,46.99
N$35  (via drill 0.35)
  other vias: 90.17,49.53
N$36  (via drill 0.35)
  other vias: 87.63,49.53
N$37  (via drill 0.35)
  other vias: 90.17,52.07
N$38  (via drill 0.35)
  other vias: 80.01,46.99
N$39  (via drill 0.35)
  other vias: 77.47,44.45
N$40  (via drill 0.35)
  other vias: 87.63,52.07
N$41  (via drill 0.35)
  other vias: 75.44,26.04
N$42  (via drill 0.35)
  other vias: 75.44,23.88
N$43  (via drill 0.35)
  other vias: 76.2,29.72
N$44  (via drill 0.35)
  other vias: 77.34,30.73
N$45  (via drill 0.35)
  other vias: 80.9,30.48
N$46  (via drill 0.35)
  other vias: 83.06,30.48
N$47  (via drill 0.35)
  other vias: 85.22,30.48
N$48  (via drill 0.35)
  other vias: 87.38,30.48
N$49  (via drill 0.35)
  other vias: 89.53,30.48
N$50  (via drill 0.35)
  other vias: 89.53,28.32
N$51  (via drill 0.35)
  other vias: 89.53,26.16
N$52  (via drill 0.35)
  other vias: 89.92,24.13
N$53  (via drill 0.35)
  other vias: 88.39,32
N$54  (via drill 0.35)
  other vias: 86.23,32
N$55  (via drill 0.35)
  other vias: 84.07,32
N$56  (via drill 0.35)
  other vias: 79.63,31.62
N$57  (via drill 0.35)
  other vias: 75.06,30.86
N$58  (via drill 0.35)
  other vias: 74.93,28.7
N$59  (via drill 0.35)
  other vias: 74.17,27.18
N$60  (via drill 0.35)
  other vias: 74.04,24.89
N$61  (via drill 0.35)
  other vias: 76.2,27.56
N$62  (via drill 0.35)
  other vias: 90.68,29.46
N$63  (via drill 0.35)
  other vias: 90.8,27.18
N$64  (via drill 0.35)
  other vias: 91.06,25.27
NSS  (via drill 0.35)
  Top 0.203: U2.29 74.32,43.97 81.93,51.58 81.93,54.31 U1.5 82.04,54.96 82.04,58.29 v82.17,58.42 | SPI.4 88.52,62.87 v88.52,59.69
  Bottom 0.203: v88.52,59.69 87.25,58.42 v82.17,58.42
RTS  (via drill 0.35)
  Top 0.203: Q1.2 45.02,21.6 45.02,24 R5.1 42.99,27.75 v43.18,27.94 | U3.24 60.19,20.43 64.26,24.5 64.26,25.91 v64.39,26.04 | v58.67,34.34 48.31,34.34 | v63.5,30.48 62.36,30.48 61.21,31.62 v59.44,31.62 | UART.5 67.06,63.12 67.06,60.58 64.77,60.58 60.07,55.88 v58.42,55.88 | v58.42,46.99 58.42,41.91 v49.53,41.91 | v44.45,30.48 48.31,34.34 | v48.77,35.94 48.31,35.48 48.31,34.34
  Bottom 0.203: v43.18,27.94 44.45,29.21 v44.45,30.48 | v58.67,34.34 59.01,34.34 59.44,33.91 v59.44,31.62 | v64.39,26.04 64.01,26.42 63.5,26.42 v63.5,30.48 | v58.42,55.88 v58.42,46.99 | v49.53,41.91 49.15,41.53 49.15,36.32 v48.77,35.94
RXD0  (via drill 0.35)
  Top 0.203: v73.02,56.9 73.02,56.01 67.34,50.32 U2.34 64.51,50.19 65.51,50.19 66.54,49.15 v68.33,49.15 | UART.3 70.86,62.35 70.86,60.84 v71.24,60.46 | v68.2,31.37 68.14,31.43 65.91,29.21 60.96,29.21 59.82,28.07 R3.2 | v68.33,42.67 68.2,42.55 68.2,36.32 v68.33,36.2
  Bottom 0.203: v73.02,56.9 72.52,57.4 72.52,58.04 71.24,59.31 v71.24,60.46 | v68.33,36.2 68.33,31.5 v68.2,31.37 | v68.33,49.15 v68.33,42.67
SCK  (via drill 0.35)
  Top 0.203: U2.30 73.31,45.24 78.99,50.93 v79.63,50.93 | v83.31,51.18 83.31,53.69 84.03,54.4 | 84.03,54.4 U1.4 | SPI.3 85.6,60.45 v88.77,57.28 | v83.57,57.02 84.03,56.56 84.03,54.4
  Bottom 0.203: v83.31,51.18 83.31,51.82 80.52,51.82 v79.63,50.93 | v88.77,57.28 88.52,57.02 v83.57,57.02
SCL  (via drill 0.35)
  Top 0.203: OLED.3 30.03,48.71 R7.1 32.13,48.33 34.61,48.33 GPIO.5 36.98,50.8 v34.92,52.85 | v34.54,55.88 34.29,56.13 v34.29,59.69 | v34.29,62.23 35.94,63.88 v37.59,63.88 | v44.96,58.8 44.07,58.8 v40.26,62.61 | v47.72,58.42 53.34,58.42 58.93,52.83 64.35,52.83 U2.36
  Bottom 0.203: v34.54,55.88 34.92,55.5 v34.92,52.85 | v34.29,59.69 v34.29,62.23 | v37.59,63.88 38.99,63.88 v40.26,62.61 | v47.72,58.42 47.59,58.55 45.97,58.55 45.72,58.8 v44.96,58.8
SDA  (via drill 0.35)
  Top 0.203: OLED.4 29.21,46.99 v34.54,46.99 | v39.58,54.61 38.35,54.61 GPIO.4 35.85,54.57 35.43,54.15 34.42,54.15 33.65,54.93 R15.1 33.02,53.66 33.02,52.07 33.98,51.12 34.55,51.12 v34.55,50.29 | v44.45,57.15 v41.02,57.15 | v47.12,57.02 47.24,57.15 52.07,57.15 60.68,48.54 63.5,48.54 63.92,48.97 64.38,48.97 U2.33
  Bottom 0.203: v39.58,54.61 41.02,56.05 v41.02,57.15 | v47.12,57.02 46.99,57.15 v44.45,57.15 | v34.55,50.29 34.8,50.29 34.8,46.99 v34.54,46.99
TXD0  (via drill 0.35)
  Top 0.203: R17.2 62.93,27.94 66.55,27.94 v70.23,31.62 | v71.09,33.91 71.63,34.45 71.63,42.42 v72.01,42.8 | v72.01,46.43 72.14,46.43 72.14,48.9 v69.98,51.05 | v60.96,50.8 61.75,51.59 U2.35 64.41,51.56 66.67,51.56 67.88,52.77 v67.69,52.96 67.82,53.09 67.82,53.59 74.42,60.2 UART.2 | v60.07,57.66 61.4,58.99 R11.2
  Bottom 0.203: v71.09,33.91 70.99,33.91 70.23,33.15 v70.23,31.62 | v72.01,46.43 v72.01,42.8 | v60.96,50.8 60.96,57.02 60.32,57.66 v60.07,57.66 | v69.98,51.05 69.72,51.05 69.47,51.31 69.34,51.31 v67.69,52.96

### Text on the board
Name: UTS ROCKETRY GROUND STATION